# EAGLE design buzz (EAGLE 6.5.0)
AUTHOR: Brad Campbell; REV: A; TITLE: Buzz
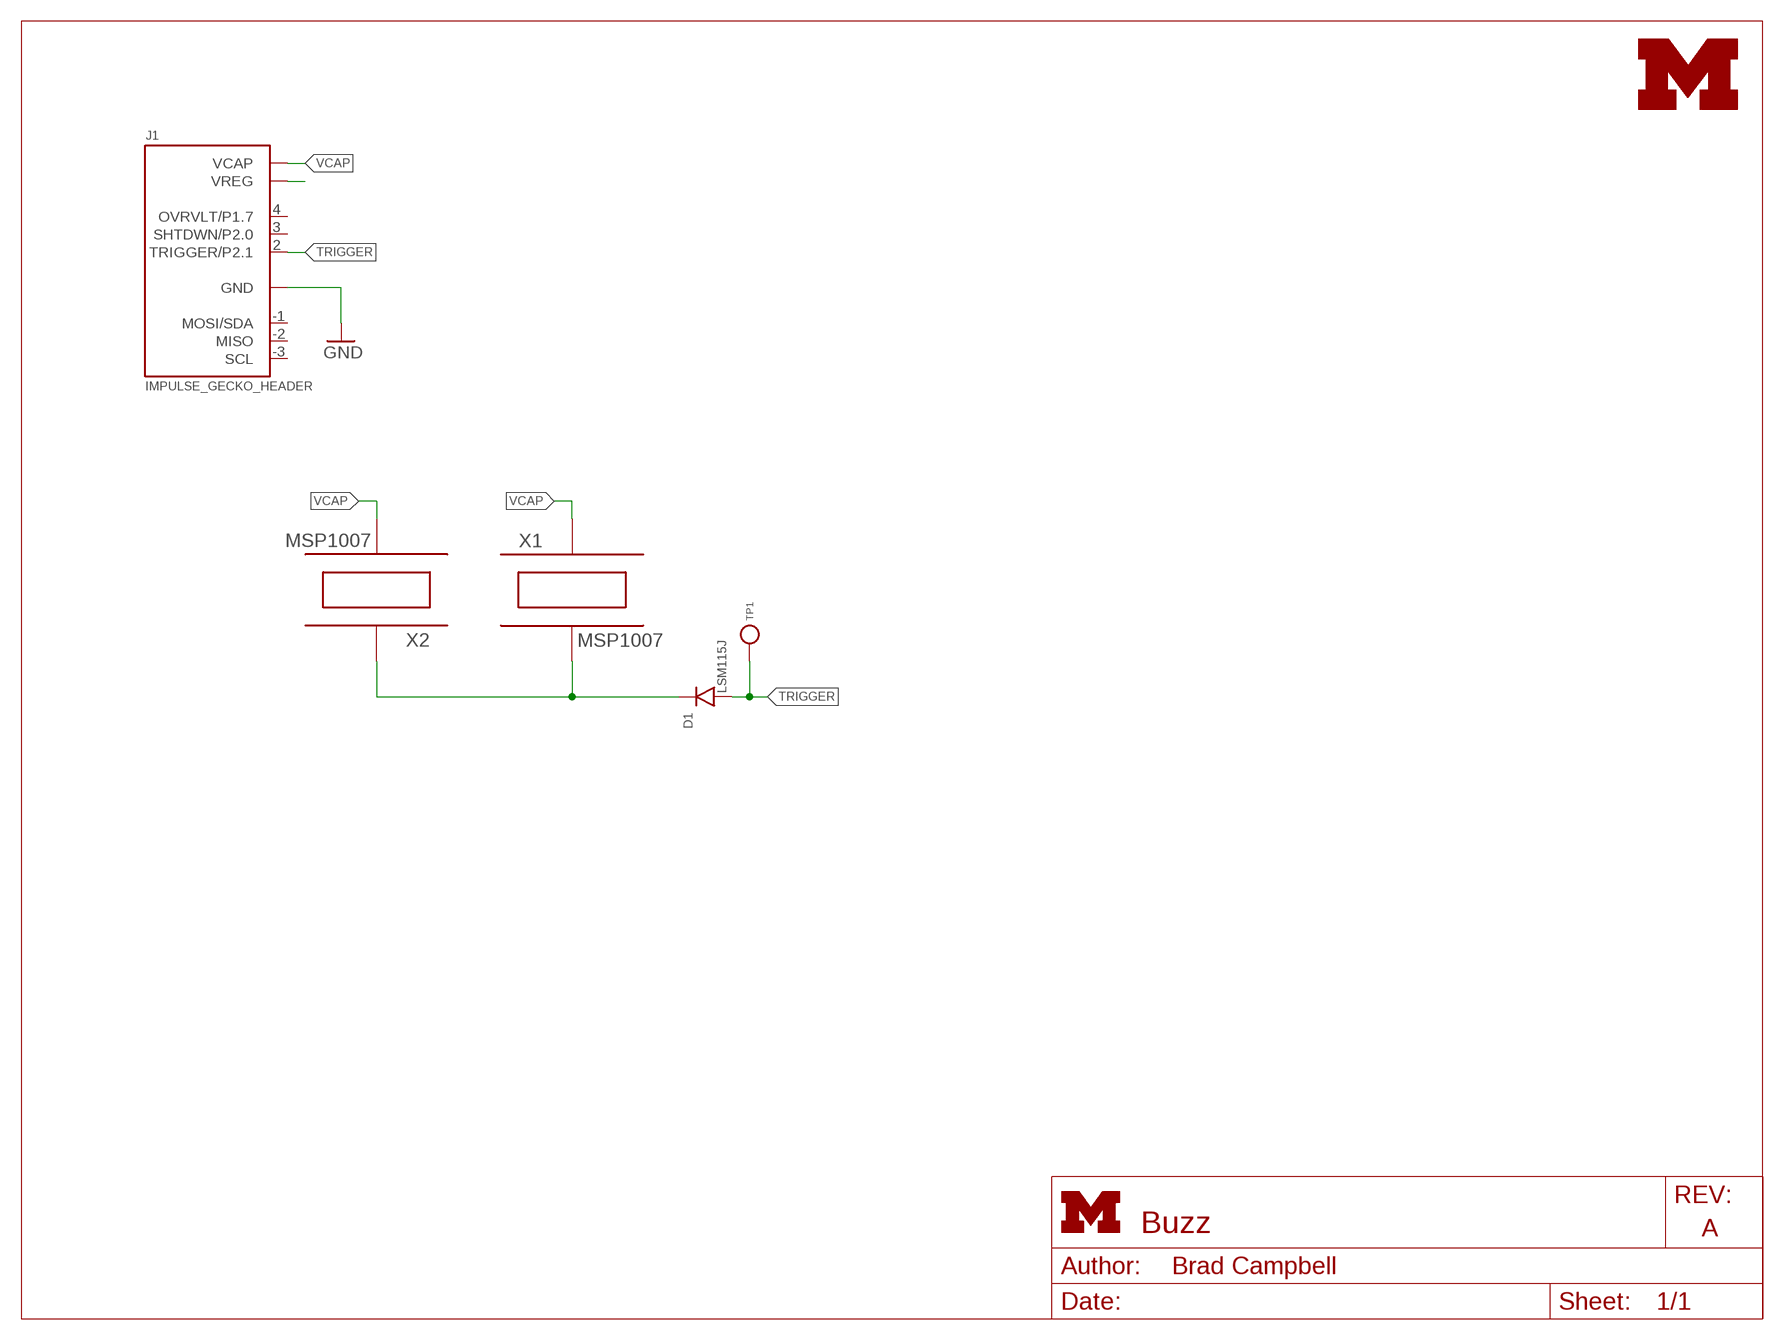
[diagram p0: schematic, sheet 1]
FRAME1 (LETTER_L): HEIGHT: 8.5in; WIDTH: 11in

## Parts
D1  LSM115J  [D0-214BA]
J1  IMPULSE_GECKO_HEADER  [HEADER1X9/0.05IN]
TP1  TEST_POINT_0.040IN  [TESTPOINT_0.040IN]
U$3  UMICH_SOLID_SMALL+  [UMICH_SOLID_100MIL]
X1  MSP1007  [MSP1007]
X2  MSP1007  [MSP1007]

## Nets
GND: J1.0(GND)
N$1: D1.C X1.2 X2.1
N$2: J1.1(VREG)
TRIGGER: D1.A J1.2(TRIGGER/P2.1) TP1.TESTPOINT
VCAP: J1.5(VCAP) X1.1 X2.2
Unconnected: J1.3(SHTDWN/P2.0) J1.4(OVRVLT/P1.7) J1.-1(MOSI/SDA) J1.-2(MISO) J1.-3(SCL)

## Library data of the parts
D1 = activator:LSM115J: Diode Schottky 15V 1A; DIGIKEY: LSM115JE3/TR13CT-ND
J1 = gecko:IMPULSE_GECKO_HEADER: Header on the impulse EPIC-esque board.
TP1 = headers:TEST_POINT_0.040IN: 0.040in Test Point; DIGIKEY: 5001K-ND
U$3 = logos:UMICH_SOLID
X1 X2 = activator:MSP1007: Piezoelectric film vibration sensor.; DIGIKEY: MSP1007-ND

## Board
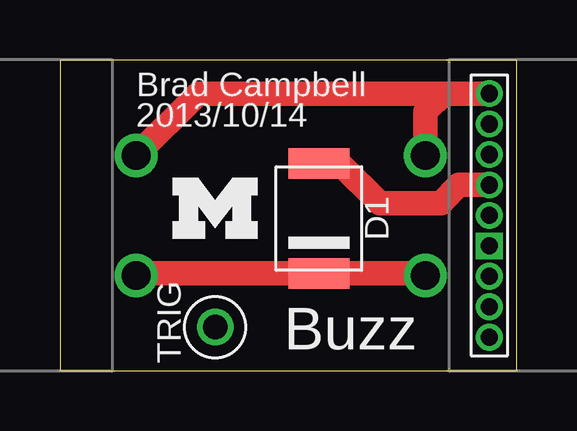
[diagram p1: board, top side]
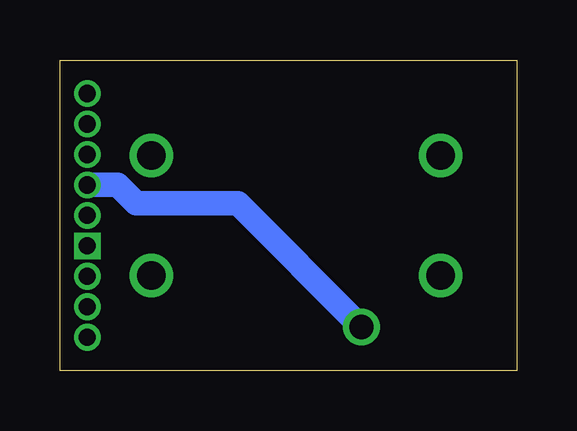
[diagram p2: board, bottom side, seen from below]

Size 19.05 x 12.95 mm. Coordinates in mm from the lower left corner, seen from the top.
Outline: 0,0 19.05,0 19.05,12.95 0,12.95 0,0
Copper layers (1*16): Top 0.0178mm / dielectric 59mil / Bottom 0.0178mm
Design rules "sunstone-2lyr_v1.0.0.3": minimum track width 6mil, minimum drill 14mil, track to track 6mil, track to pad 6mil, pad to pad 6mil, via to via 6mil, smd to smd 6mil, copper to edge 20mil, drill to drill 16mil, minimum pad ring 8mil, minimum via ring 8mil, stop-mask expansion 3mil, vias tented up to drill 0mil, thermal gap 10mil

### Footprints (pad centres in the part's own frame; a part is rotated, then mirrored left to right if it is on the bottom)
D0-214BA = smd 1.27 x 2.54: A -2.286,0; C 2.286,0
HEADER1X9/0.05IN = drill 0.711 pad 1.016 square: 0 -1.27,0 | drill 0.711 pad 1.016: 1 0,0; 2 1.27,0; 3 2.54,0; 4 3.81,0; 5 5.08,0; -1 -2.54,0; -2 -3.81,0; -3 -5.08,0
TESTPOINT_0.040IN = drill 1.016: TESTPOINT 0,0
MSP1007 = drill 1.2: 1 0,2.5; 2 0,-2.5

### Placement (x,y rotation side)
D1  10.79,6.35 270 top
J1  17.91,6.48 90 top
TP1  6.48,1.83 0 top
U$3  4.7,5.51 0 top
X1  3.17,6.48 0 top
X2  15.24,6.48 180 top

### Tracks (layer width: path | path; a pad name or v marks a point on that pad's centre or on a via)
N$1
  Top 1.016: X1.2 3.26,4.06 D1.C 15.15,4.06 X2.1
TRIGGER
  Top 1.016: D1.A 11.68,8.64 13.34,6.99 15.88,6.99 16.64,7.75 J1.2
  Bottom 1.016: TP1.TESTPOINT 11.63,6.99 15.88,6.99 16.64,7.75 J1.2
VCAP
  Top 1.016: J1.5 16.51,11.56 16,11.56 | 16,11.56 15.24,10.79 X2.2 | X1.1 5.75,11.56 16,11.56

### Text on the board
tPlace: Brad Campbell | 2013/10/14 | TRIG | Buzz